# Altium schematic sheet Power.SchDoc
size A4; SheetNumber: 1; SheetTotal: 3
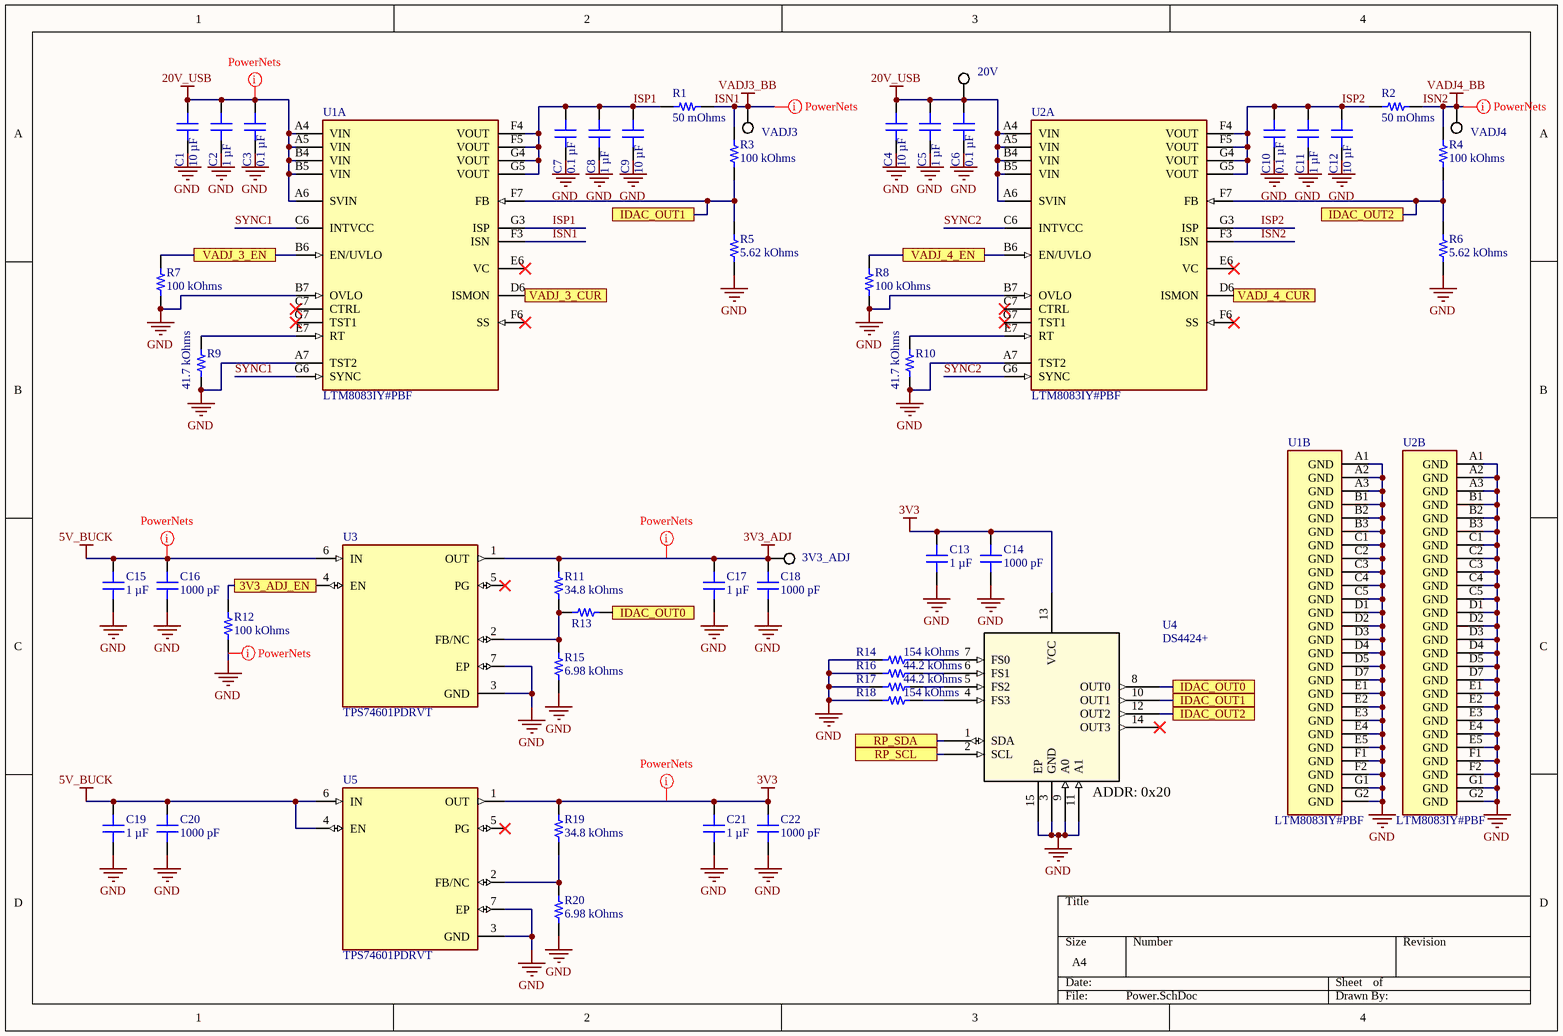
[diagram p0: Power.SchDoc]

## Parts
3V3_ADJ  TP_SMD_1  [TP_1.0mm]  (value not drawn)  (no BOM)
20V  TP_SMD_1  [TP_1.0mm]  (value not drawn)  (no BOM)
C1  10 µF  [CAP 1210_3225 - 1MM]
C2  1 µF  [CAP 0603_1608]
C3  0.1 µF  [CAP 0603_1608]
C4  10 µF  [CAP 1210_3225 - 1MM]
C5  1 µF  [CAP 0603_1608]
C6  0.1 µF  [CAP 0603_1608]
C7  0.1 µF  [CAP 0603_1608]
C8  1 µF  [CAP 0603_1608]
C9  10 µF  [CAP 1210_3225 - 1MM]
C10  0.1 µF  [CAP 0603_1608]
C11  1 µF  [CAP 0603_1608]
C12  10 µF  [CAP 1210_3225 - 1MM]
C13  1 µF  [CAP 0603_1608]
C14  1000 pF  [CAP 0603_1608]
C15  1 µF  [CAP 0603_1608]
C16  1000 pF  [CAP 0603_1608]
C17  1 µF  [CAP 0603_1608]
C18  1000 pF  [CAP 0603_1608]
C19  1 µF  [CAP 0603_1608]
C20  1000 pF  [CAP 0603_1608]
C21  1 µF  [CAP 0603_1608]
C22  1000 pF  [CAP 0603_1608]
R1  50 mOhms  [STACKPOLE CSR1206]
R2  50 mOhms  [STACKPOLE CSR1206]
R3  100 kOhms  [RES 0603_1608]
R4  100 kOhms  [RES 0603_1608]
R5  5.62 kOhms  [RES 0603_1608]
R6  5.62 kOhms  [RES 0603_1608]
R7  100 kOhms  [RES 0603_1608]
R8  100 kOhms  [RES 0603_1608]
R9  41.7 kOhms  [RES 0603_1608]
R10  41.7 kOhms  [RES 0603_1608]
R11  34.8 kOhms  [RES 0603_1608]
R12  100 kOhms  [RES 0603_1608]
R13  (no value)  [RES 0603_1608]
R14  154 kOhms  [RES 0603_1608]
R15  6.98 kOhms  [RES 0603_1608]
R16  44.2 kOhms  [RES 0603_1608]
R17  44.2 kOhms  [RES 0603_1608]
R18  154 kOhms  [RES 0603_1608]
R19  34.8 kOhms  [RES 0603_1608]
R20  6.98 kOhms  [RES 0603_1608]
U1  LTM8083IY#PBF  [FP-BGA-49-05-08-1518-MFG]  (parts A,B of 2)
U2  LTM8083IY#PBF  [FP-BGA-49-05-08-1518-MFG]  (parts A,B of 2)
U3  TPS74601PDRVT  [SON65P200X200X80-7N]
U4  DS4424+  [21-0137_T1433+2_MXM]
U5  TPS74601PDRVT  [SON65P200X200X80-7N]
VADJ3  TP_SMD_1  [TP_1.0mm]  (value not drawn)  (no BOM)
VADJ4  TP_SMD_1  [TP_1.0mm]  (value not drawn)  (no BOM)

## Ports
3V3_ADJ_EN, IDAC_OUT0, IDAC_OUT1, IDAC_OUT2, RP_SCL, RP_SDA, VADJ_3_CUR, VADJ_3_EN, VADJ_4_CUR, VADJ_4_EN

## Nets
3V3: C13.2 C14.2 C21.2 C22.2 R19.2 U4.13(VCC) U5.1(OUT)
3V3_ADJ: 3V3_ADJ.1 C17.2 C18.2 R11.2 U3.1(OUT)
5V_BUCK: C15.2 C16.2 C19.2 C20.2 U3.6(IN) U5.4(EN) U5.6(IN)
20V_USB: 20V.1 C1.2 C2.2 C3.2 C4.2 C5.2 C6.2 U1.A4(VIN) U1.A5(VIN) U1.A6(SVIN) U1.B4(VIN) U1.B5(VIN) U2.A4(VIN) U2.A5(VIN) U2.A6(SVIN) U2.B4(VIN) U2.B5(VIN)
GND: C1.1 C2.1 C3.1 C4.1 C5.1 C6.1 C7.1 C8.1 C9.1 C10.1 C11.1 C12.1 C13.1 C14.1 C15.1 C16.1 C17.1 C18.1 C19.1 C20.1 C21.1 C22.1 R5.1 R6.1 R7.1 R8.1 R9.1 R10.1 R12.1 R14.1 R15.1 R16.2 R17.2 R18.1 R20.1 U1.A1(GND) U1.A2(GND) U1.A3(GND) U1.A7(TST2) U1.B1(GND) U1.B2(GND) U1.B3(GND) U1.B7(OVLO) U1.C1(GND) U1.C2(GND) U1.C3(GND) U1.C4(GND) U1.C5(GND) U1.D1(GND) U1.D2(GND) U1.D3(GND) U1.D4(GND) U1.D5(GND) U1.D7(GND) U1.E1(GND) U1.E2(GND) U1.E3(GND) U1.E4(GND) U1.E5(GND) U1.F1(GND) U1.F2(GND) U1.G1(GND) U1.G2(GND) U2.A1(GND) U2.A2(GND) U2.A3(GND) U2.A7(TST2) U2.B1(GND) U2.B2(GND) U2.B3(GND) U2.B7(OVLO) U2.C1(GND) U2.C2(GND) U2.C3(GND) U2.C4(GND) U2.C5(GND) U2.D1(GND) U2.D2(GND) U2.D3(GND) U2.D4(GND) U2.D5(GND) U2.D7(GND) U2.E1(GND) U2.E2(GND) U2.E3(GND) U2.E4(GND) U2.E5(GND) U2.F1(GND) U2.F2(GND) U2.G1(GND) U2.G2(GND) U3.3(GND) U3.7(EP) U4.3(GND) U4.9(A0) U4.11(A1) U4.15(EP) U5.3(GND) U5.7(EP)
ISN1: R1.2 R3.2 U1.F3(ISN) VADJ3.1  [also labelled VADJ3_BB]
ISN2: R2.2 R4.2 U2.F3(ISN) VADJ4.1  [also labelled VADJ4_BB]
3V3_ADJ_EN: R12.2 U3.4(EN) ; port 3V3_ADJ_EN
IDAC_OUT0: R13.2 U4.8(OUT0) ; port IDAC_OUT0
IDAC_OUT1: R3.1 R5.2 U1.F7(FB) U4.10(OUT1) ; port IDAC_OUT1
IDAC_OUT2: R4.1 R6.2 U2.F7(FB) U4.12(OUT2) ; port IDAC_OUT2
ISP1: C7.2 C8.2 C9.2 R1.1 U1.F4(VOUT) U1.F5(VOUT) U1.G3(ISP) U1.G4(VOUT) U1.G5(VOUT)
ISP2: C10.2 C11.2 C12.2 R2.1 U2.F4(VOUT) U2.F5(VOUT) U2.G3(ISP) U2.G4(VOUT) U2.G5(VOUT)
RP_SCL: U4.2(SCL) ; port RP_SCL
RP_SDA: U4.1(SDA) ; port RP_SDA
SYNC1: U1.C6(INTVCC) U1.G6(SYNC)
SYNC2: U2.C6(INTVCC) U2.G6(SYNC)
VADJ_3_CUR: U1.D6(ISMON) ; port VADJ_3_CUR
VADJ_3_EN: R7.2 U1.B6(EN/UVLO) ; port VADJ_3_EN
VADJ_4_CUR: U2.D6(ISMON) ; port VADJ_4_CUR
VADJ_4_EN: R8.2 U2.B6(EN/UVLO) ; port VADJ_4_EN
NetR9_2: R9.2 U1.E7(RT)
NetR10_2: R10.2 U2.E7(RT)
NetR11_1: R11.1 R13.1 R15.2 U3.2(FB/NC)
NetR14_2: R14.2 U4.7(FS0)
NetR16_1: R16.1 U4.6(FS1)
NetR17_1: R17.1 U4.5(FS2)
NetR18_2: R18.2 U4.4(FS3)
NetR19_1: R19.1 R20.2 U5.2(FB/NC)

Not connected (* = marked no-connect by the designer): U1 C7(CTRL)* E6(VC)* F6(SS)* G7(TST1)*; U2 C7(CTRL)* E6(VC)* F6(SS)* G7(TST1)*; U3 5(PG)*; U4 14(OUT3)*; U5 5(PG)*

## Layout directives
net class PowerNets: 3V3, 3V3_ADJ, 5V_BUCK, 20V_USB, GND, ISN1, ISN2

## Notes on the sheet
- (near U4) ADDR: 0x20

## Library data of the parts
C1 C4 C9 C12 = GMC32X5R106M50NT: CAP1210 X5R 10UF 20% 50V; manufacturer: Cal-Chip Electronics, Inc.; Part Number: GMC32X5R106M50NT; Value: 10 µF; Applications: General Purpose; Capacitance: 10 µF; componentlink1description: Datasheet; componentlink1url: https://calchip.com/wp-content/uploads/2023/05/gmc_series.pdf; componentlink2description: DigiKey Link; componentlink2url: https://www.digikey.com/en/products/detail/cal-chip-electronics-inc/GMC32X5R106M50NT/21802006; Device Package: 1210 (3225 Metric); lastupdated: 04/06/2024 19:20:41; Lifecycle Status: Active; Minimum Order: 1; Mounting Type: Surface Mount, MLCC; Operating Temperature: -55°C ~ 85°C; Package / Case: 1210 (3225 Metric); packaging: TapeAndReel; partid: 58255; price: 0.13; series: GMC; Size / Dimension: 0.126" L x 0.098" W (3.20mm x 2.50mm); Supplier 1: DigiKey; Supplier Part Number 1: 4713-GMC32X5R106M50NTCT-ND; Temperature Coefficient: X5R; Thickness (Max): 0.110" (2.80mm); Tolerance: ±20%; Voltage - Rated: 50V
C2 C5 C8 C11 C13 C15 C17 C19 C21 = C1608X5R1H105K080AB: CAP CER 1UF 50V X5R 0603; manufacturer: TDK Corporation; Tolerance: ±10%; Part Number: C1608X5R1H105K080AB; Value: 1 µF; Applications: General Purpose; Capacitance: 1 µF; componentlink1description: Datasheet; componentlink1url: https://product.tdk.com/info/en/catalog/datasheets/mlcc_commercial_general_en.pdf?ref_disty=digikey; componentlink2description: DigiKey Link; componentlink2url: https://www.digikey.com/en/products/detail/tdk-corporation/C1608X5R1H105K080AB/2732903; Device Package: 0603 (1608 Metric); Features: Low ESL; lastupdated: 09/02/2024 20:10:02; Lifecycle Status: Active; Minimum Order: 1; Mounting Type: Surface Mount, MLCC; Operating Temperature: -55°C ~ 85°C; Package / Case: 0603 (1608 Metric); packaging: TapeAndReel; partid: 36337; Part Status: Active; price: 0.02; series: C; Size / Dimension: 0.063" L x 0.031" W (1.60mm x 0.80mm); Supplier 1: DigiKey; Supplier Part Number 1: 445-7468-1-ND; Temperature Coefficient: X5R; Thickness (Max): 0.035" (0.90mm); Voltage - Rated: 50V
C3 C6 C7 C10 = CGA3E2X7R1H104M080AE: CAP CER 0.1UF 50V X7R 0603; manufacturer: TDK Corporation; Tolerance: ±20%; Part Number: CGA3E2X7R1H104M080AE; Value: 0.1 µF; Applications: Automotive, Boardflex Sensitive; Capacitance: 0.1 µF; componentlink1description: Datasheet; componentlink1url: https://product.tdk.com/info/en/catalog/datasheets/mlcc_automotive_soft_en.pdf?ref_disty=digikey; componentlink2description: DigiKey Link; componentlink2url: https://www.digikey.com/en/products/detail/tdk-corporation/CGA3E2X7R1H104M080AE/4490595; Device Package: 0603 (1608 Metric); Features: Soft Termination; lastupdated: 09/02/2024 20:10:15; Lifecycle Status: Active; Minimum Order: 1; Mounting Type: Surface Mount, MLCC; Operating Temperature: -55°C ~ 125°C; Package / Case: 0603 (1608 Metric); packaging: TapeAndReel; partid: 13634; Part Status: Active; price: 0.03; Ratings: AEC-Q200; series: CGA; Size / Dimension: 0.063" L x 0.031" W (1.60mm x 0.80mm); Supplier 1: DigiKey; Supplier Part Number 1: 445-15958-1-ND; Temperature Coefficient: X7R; Thickness (Max): 0.037" (0.95mm); Voltage - Rated: 50V
C14 C16 C18 C20 C22 = CC0603GRNPO8BN102: CAP CER 1000PF 25V C0G/NPO 0603; manufacturer: Yageo; Temperature Coefficient: C0G, NP0; Tolerance: ±2%; Part Number: CC0603GRNPO8BN102; Value: 1000 pF; Applications: General Purpose; Capacitance: 1000 pF; componentlink1description: Datasheet; componentlink1url: https://www.yageo.com/upload/media/product/productsearch/datasheet/mlcc/UPY-GP_NP0_16V-to-50V_17.pdf; componentlink2description: DigiKey Link; componentlink2url: https://www.digikey.com/en/products/detail/yageo/CC0603GRNPO8BN102/5883535; Device Package: 0603 (1608 Metric); lastupdated: 09/02/2024 20:10:07; Lifecycle Status: Active; Minimum Order: 1; Mounting Type: Surface Mount, MLCC; Operating Temperature: -55°C ~ 125°C; Package / Case: 0603 (1608 Metric); packaging: TapeAndReel; partid: 17388; Part Status: Active; price: 0.02; series: CC; Size / Dimension: 0.063" L x 0.031" W (1.60mm x 0.80mm); Supplier 1: DigiKey; Supplier Part Number 1: 311-3914-1-ND; Thickness (Max): 0.035" (0.90mm); Voltage - Rated: 25V
R1 R2 = ERJ-8BWJR050V: RES 0.05 OHM 5% 1W 1206; Manufacturer: Panasonic Electronic Components; Temperature Coefficient: 0/ +100ppm/°C; Part Number: ERJ-8BWJR050V; Package / Case: 1206 (3216 Metric); ComponentLink1Description: Datasheet; ComponentLink1URL: https://industrial.panasonic.com/cdbs/www-data/pdf/RDN0000/AOA0000C313.pdf; ComponentLink2Description: DigiKey Link; ComponentLink2URL: https://www.digikey.com/en/products/detail/panasonic-electronic-components/ERJ-8BWJR050V/5647727; Composition: Thick Film; Device Package: 1206 (3216 Metric); Features: Automotive AEC-Q200, Current Sense; Height - Seated (Max): 0.030" (0.75mm); LastUpdated: 03/06/2024 19:49:36; Lifecycle Status: Active; Minimum Order: 1; Number of Terminations: 2; Operating Temperature: -55°C ~ 155°C; Packaging: TapeAndReel; PartId: 2335; Part Status: Active; Power (Watts): 1W; Price: 0.11; Ratings: AEC-Q200; Resistance: 50 mOhms; Series: ERJ-8BW; Size / Dimension: 0.126" L x 0.063" W (3.20mm x 1.60mm); Supplier 1: DigiKey; Supplier Part Number 1: P17694CT-ND; Supplier Device Package: 1206; Tolerance: ±5%; Value: 50 mOhms
R3 R4 R7 R8 R12 = SG73P1JTTD1003F: RES 100K OHM 1% 1/3W 0603; Manufacturer: KOA Speer Electronics, Inc.; Power (Watts): 0.333W, 1/3W; Temperature Coefficient: ±100ppm/°C; Part Number: SG73P1JTTD1003F; Value: 100 kOhms; ComponentLink1Description: Datasheet; ComponentLink1URL: https://www.koaspeer.com/pdfs/SG73P.pdf; ComponentLink2Description: DigiKey Link; ComponentLink2URL: https://www.digikey.com/en/products/detail/koa-speer-electronics-inc/SG73P1JTTD1003F/10188341; Composition: Thick Film; Device Package: 0603 (1608 Metric); Features: Automotive AEC-Q200, Pulse Withstanding; Height - Seated (Max): 0.022" (0.55mm); LastUpdated: 09/02/2024 20:40:28; Lifecycle Status: Active; Minimum Order: 1; Number of Terminations: 2; Operating Temperature: -55°C ~ 155°C; Package / Case: 0603 (1608 Metric); Packaging: TapeAndReel; PartId: 83707; Price: 0.01; Ratings: AEC-Q200; Resistance: 100 kOhms; Series: SG73P; Size / Dimension: 0.063" L x 0.031" W (1.60mm x 0.80mm); Supplier 1: DigiKey; Supplier Part Number 1: 2019-SG73P1JTTD1003FCT-ND; Supplier Device Package: 0603; Tolerance: ±1%
R5 R6 = ERJ-3EKF5621V: RES SMD 5.62K OHM 1% 1/10W 0603; Manufacturer: Panasonic Electronic Components; Power (Watts): 0.1W, 1/10W; Temperature Coefficient: ±100ppm/°C; Part Number: ERJ-3EKF5621V; Value: 5.62 kOhms; ComponentLink1Description: Datasheet; ComponentLink1URL: https://industrial.panasonic.com/cdbs/www-data/pdf/RDA0000/AOA0000C304.pdf; ComponentLink2Description: DigiKey Link; ComponentLink2URL: https://www.digikey.com/en/products/detail/panasonic-electronic-components/ERJ-3EKF5621V/196387; Composition: Thick Film; Device Package: 0603 (1608 Metric); Features: Automotive AEC-Q200; Height - Seated (Max): 0.022" (0.55mm); LastUpdated: 09/02/2024 20:41:56; Lifecycle Status: Active; Minimum Order: 1; Number of Terminations: 2; Operating Temperature: -55°C ~ 155°C; Package / Case: 0603 (1608 Metric); Packaging: TapeAndReel; PartId: 26114; Part Status: Active; Price: 0.01; Ratings: AEC-Q200; Resistance: 5.62 kOhms; Series: ERJ-3EK; Size / Dimension: 0.063" L x 0.031" W (1.60mm x 0.80mm); Supplier 1: DigiKey; Supplier Part Number 1: P5.62KHCT-ND; Supplier Device Package: 0603; Tolerance: ±1%
R9 R10 = RN73R1JTTD4172F10: RES 41.7K OHM 1% 1/10W 0603; Manufacturer: KOA Speer Electronics, Inc.; Power (Watts): 0.1W, 1/10W; Temperature Coefficient: ±10ppm/°C; Part Number: RN73R1JTTD4172F10; Value: 41.7 kOhms; ComponentLink1Description: Datasheet; ComponentLink1URL: https://media.digikey.com/pdf/Data%20Sheets/KOA%20Speer/RN73R_Type_DS.pdf; ComponentLink2Description: DigiKey Link; ComponentLink2URL: https://www.digikey.com/en/products/detail/koa-speer-electronics-inc/RN73R1JTTD4172F10/10017113; Composition: Thin Film; Device Package: 0603 (1608 Metric); Features: Automotive AEC-Q200, Moisture Resistant; Height - Seated (Max): 0.022" (0.55mm); LastUpdated: 09/02/2024 20:41:25; Lifecycle Status: Active; Minimum Order: 1; Number of Terminations: 2; Operating Temperature: -55°C ~ 155°C; Package / Case: 0603 (1608 Metric); Packaging: TapeAndReel; PartId: 62816; Part Status: Active; Price: 0.08; Ratings: AEC-Q200; Resistance: 41.7 kOhms; Series: RN73R; Size / Dimension: 0.063" L x 0.031" W (1.60mm x 0.80mm); Supplier 1: DigiKey; Supplier Part Number 1: 2019-RN73R1JTTD4172F10CT-ND; Supplier Device Package: 0603; Tolerance: ±1%
R11 R19 = CRCW060334K8FKEA: RES SMD 34.8K OHM 1% 1/10W 0603; Manufacturer: Vishay Dale; Power (Watts): 0.1W, 1/10W; Temperature Coefficient: ±100ppm/°C; Part Number: CRCW060334K8FKEA; Value: 34.8 kOhms; ComponentLink1Description: Datasheet; ComponentLink1URL: http://www.vishay.com/docs/20035/dcrcwe3.pdf; ComponentLink2Description: DigiKey Link; ComponentLink2URL: https://www.digikey.com/en/products/detail/vishay-dale/CRCW060334K8FKEA/1174842; Composition: Thick Film; Device Package: 0603 (1608 Metric); Features: Automotive AEC-Q200; Height - Seated (Max): 0.020" (0.50mm); LastUpdated: 09/02/2024 20:43:05; Lifecycle Status: Active; Minimum Order: 1; Number of Terminations: 2; Operating Temperature: -55°C ~ 155°C; Package / Case: 0603 (1608 Metric); Packaging: TapeAndReel; PartId: 12662; Part Status: Active; Price: 0.01; Ratings: AEC-Q200; Resistance: 34.8 kOhms; Series: CRCW; Size / Dimension: 0.061" L x 0.033" W (1.55mm x 0.85mm); Supplier 1: DigiKey; Supplier Part Number 1: 541-34.8KHCT-ND; Supplier Device Package: 0603; Tolerance: ±1%
R13 = MCT0603MZ0000ZP500: RES 0 OHM JUMPER 1/8W 0603; Manufacturer: Vishay Beyschlag; Power (Watts): 0.125W, 1/8W; Part Number: MCT0603MZ0000ZP500; ComponentLink1Description: Datasheet; ComponentLink1URL: http://www.vishay.com/docs/28760/mcat_pro.pdf; ComponentLink2Description: DigiKey Link; ComponentLink2URL: http://digikey.com/product-detail/en/vishay-beyschlag/MCT0603MZ0000ZP500/749-1745-1-ND/7348053; Composition: Thin Film; Device Package: 0603 (1608 Metric); Features: Anti-Sulfur, Automotive AEC-Q200; Height - Seated (Max): 0.022" (0.55mm); LastUpdated: 14/02/2022 15:05:22; Lifecycle Status: Active; Minimum Order: 1; Number of Terminations: 2; Operating Temperature: -55°C ~ 155°C; Package / Case: 0603 (1608 Metric); Packaging: TapeAndReel; PartId: 10258; Part Status: Active; Price: 0.04; Ratings: AEC-Q200; Series: MCT AT - Professional; Size / Dimension: 0.061" L x 0.033" W (1.55mm x 0.85mm); Supplier 1: DigiKey; Supplier Part Number 1: 749-1745-1-ND; Supplier Device Package: 0603; Tolerance: Jumper
R14 R18 = AC0603FR-07154KL: RES SMD 154K OHM 1% 1/10W 0603; Manufacturer: Yageo; Power (Watts): 0.1W, 1/10W; Temperature Coefficient: ±100ppm/°C; Part Number: AC0603FR-07154KL; Value: 154 kOhms; ComponentLink1Description: Datasheet; ComponentLink1URL: https://media.digikey.com/pdf/Data%20Sheets/Yageo%20PDFs/AC%20Series,%20Automotive.pdf; ComponentLink2Description: DigiKey Link; ComponentLink2URL: https://www.digikey.com/en/products/detail/yageo/AC0603FR-07154KL/5895797; Composition: Thick Film; Device Package: 0603 (1608 Metric); Features: Automotive AEC-Q200, Moisture Resistant; Height - Seated (Max): 0.022" (0.55mm); LastUpdated: 09/02/2024 20:40:39; Lifecycle Status: Active; Minimum Order: 1; Number of Terminations: 2; Operating Temperature: -55°C ~ 155°C; Package / Case: 0603 (1608 Metric); Packaging: CutTape; PartId: 79462; Price: 0.01; Ratings: AEC-Q200; Resistance: 154 kOhms; Series: AC; Size / Dimension: 0.063" L x 0.031" W (1.60mm x 0.80mm); Supplier 1: DigiKey; Supplier Part Number 1: 13-AC0603FR-07154KLCT-ND; Supplier Device Package: 0603; Tolerance: ±1%
R15 R20 = CRCW06036K98FKEA: RES SMD 6.98K OHM 1% 1/10W 0603; Manufacturer: Vishay Dale; Power (Watts): 0.1W, 1/10W; Temperature Coefficient: ±100ppm/°C; Part Number: CRCW06036K98FKEA; Value: 6.98 kOhms; ComponentLink1Description: Datasheet; ComponentLink1URL: http://www.vishay.com/docs/20035/dcrcwe3.pdf; ComponentLink2Description: DigiKey Link; ComponentLink2URL: https://www.digikey.com/en/products/detail/vishay-dale/CRCW06036K98FKEA/1174765; Composition: Thick Film; Device Package: 0603 (1608 Metric); Features: Automotive AEC-Q200; Height - Seated (Max): 0.020" (0.50mm); LastUpdated: 09/02/2024 20:43:25; Lifecycle Status: Active; Minimum Order: 1; Number of Terminations: 2; Operating Temperature: -55°C ~ 155°C; Package / Case: 0603 (1608 Metric); Packaging: TapeAndReel; PartId: 7857; Part Status: Active; Price: 0.01; Ratings: AEC-Q200; Resistance: 6.98 kOhms; Series: CRCW; Size / Dimension: 0.061" L x 0.033" W (1.55mm x 0.85mm); Supplier 1: DigiKey; Supplier Part Number 1: 541-6.98KHCT-ND; Supplier Device Package: 0603; Tolerance: ±1%
R16 R17 = RC0603FR-0744K2L: RES 44.2K OHM 1% 1/10W 0603; Manufacturer: Yageo; Power (Watts): 0.1W, 1/10W; Temperature Coefficient: ±100ppm/°C; Part Number: RC0603FR-0744K2L; Value: 44.2 kOhms; ComponentLink1Description: Datasheet; ComponentLink1URL: https://www.yageo.com/upload/media/product/productsearch/datasheet/rchip/PYu-RC_Group_51_RoHS_L_10.pdf; ComponentLink2Description: DigiKey Link; ComponentLink2URL: https://www.digikey.com/en/products/detail/yageo/RC0603FR-0744K2L/727241; Composition: Thick Film; Device Package: 0603 (1608 Metric); Features: Moisture Resistant; Height - Seated (Max): 0.022" (0.55mm); LastUpdated: 09/02/2024 20:43:25; Lifecycle Status: Active; Minimum Order: 1; Number of Terminations: 2; Operating Temperature: -55°C ~ 155°C; Package / Case: 0603 (1608 Metric); Packaging: CutTape; PartId: 7751; Part Status: Active; Price: 0.01; Resistance: 44.2 kOhms; Series: RC_L; Size / Dimension: 0.063" L x 0.031" W (1.60mm x 0.80mm); Supplier 1: DigiKey; Supplier Part Number 1: 311-44.2KHRCT-ND; Supplier Device Package: 0603; Tolerance: ±1%
U1 U2 = CMP-09139-000213-1: 36VIN, 1.5A BUCK-BOOST UMODULE
U3 U5 = TPS74601PDRVT: 1-A, low-IQ, high-accuracy, adjustable ultra-low-dropout voltage regulator with power good & enable; MF: Texas Instruments; SnapEDA_Link: https://www.snapeda.com/parts/TPS74601PDRVT/Texas+Instruments/view-part/?ref=snap; Package: WSON-6 Texas Instruments; Value: *; MP: TPS74601PDRVT; Check_prices: https://www.snapeda.com/parts/TPS74601PDRVT/Texas+Instruments/view-part/?ref=eda
U4 = DS4424: Two-/Four-Channel, IÂ²C, 7-Bit Sink/Source Current DAC; Manufacturer_Name: Analog Devices Inc; Manufacturer_Part_Number: ds4424n+; Copyright: Copyright (C) 2026 Ultra Librarian. All rights reserved.; RefDes: RefDes; Type: Type